# Altium project IRControlArduino.PrjPcb
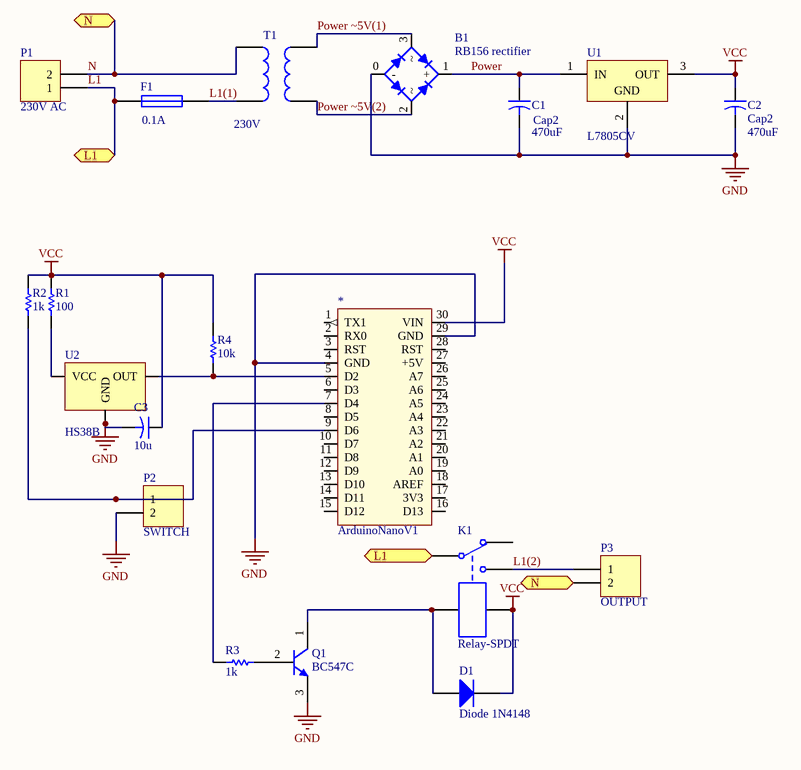
[diagram p0: schemat.SchDoc]
1 sheet, 19 parts. Net scope: flat (ports and power ports of the same name join across sheets).
Board file: PCB1.PcbDoc

## Sheet schemat.SchDoc
size A4

### Parts
*  ArduinoNanoV1  [DIP30]
B1  RB156 rectifier  [RB15]
C1  Cap2  value 470uF  [CAPR5-4X5]
C2  Cap2  value 470uF  [CAPR5-4X5]
C3  value 10u  [Capacitor]  (hidden comment: Cap2)
D1  Diode 1N4148  [DO-35]
F1  current: 0.1A  [PIN-W2/E2.8]  (hidden comment: Fuse 1)
K1  Relay-SPDT  [RELAY_OMRON_G5LE-1]
P1  230V AC  [ARK2]
P2  SWITCH  [ARK2]
P3  OUTPUT  [ARK2]
Q1  BC547C  [ONSC-TO-92-3-29-10_BL]
R1  value 100  [AXIAL-0.3]  (hidden comment: Res1)
R2  value 1k  [AXIAL-0.3]  (hidden comment: Res1)
R3  value 1k  [AXIAL-0.3]  (hidden comment: Res1)
R4  value 10k  [AXIAL-0.3]  (hidden comment: Res1)
T1  input voltage: 230V  [trafo HAHN 12V 3VA]  (hidden comment: Trans)
U1  L7805CV  [TO220]
U2  HS38B  [HS38B_3pin]

### Ports
L1, N

### Nets
GND: *.4(GND) *.29(GND) B1.0(-) C1.2 C2.2 C3.2 P2.2 Q1.3(E) U1.2(GND) U2.2(GND)
VCC: *.30(VIN) C2.1 C3.1 D1.2(K) K1.5 R1.2 R2.2 R4.2 U1.3(OUT)
L1: F1.1 K1.1 P1.1 ; port L1
L1(1): F1.2 T1.2
L1(2): K1.3 P3.1
N: P1.2 P3.2 T1.1 ; port N
Power: B1.1(+) C1.1 U1.1(IN)
Power ~5V(1): B1.3 T1.3
Power ~5V(2): B1.2 T1.4
Net*_5: *.5(D2) R4.1 U2.3(OUT)
Net*_7: *.7(D4) R3.2
Net*_9: *.9(D6) P2.1 R2.1
NetD1_1: D1.1(A) K1.4 Q1.1(C)
NetQ1_2: Q1.2(B) R3.1
NetR1_1: R1.1 U2.1(VCC)

Not connected (* = marked no-connect by the designer): * 1(TX1) 2(RX0) 3(RST) 6(D3) 8(D5) 10(D7) 11(D8) 12(D9) 13(D10) 14(D11) 15(D12) 16(D13) 17(3V3) 18(AREF) 19(A0) 20(A1) 21(A2) 22(A3) 23(A4) 24(A5) 25(A6) 26(A7) 27(+5V) 28(RST); K1 2

### Library data of the parts
C1-C3 = Cap2: Capacitor; Published: 23-Sep-2002; PackageReference: CAPR5-4X5; Publisher: Altium Limited; PackageDescription: Capacitor; 2 Leads
D1 = Diode 1N4148: High Conductance Fast Diode; Published: 8-Jun-2000; LatestRevisionDate: 17-Jul-2002; LatestRevisionNote: Re-released for DXP Platform.; DatasheetVersion: 1997; PackageReference: DO-35; Publisher: Altium Limited; PackageDescription: Diode, Axial; Body 3.8 x 1.9 mm (LxDia. max), Lead Dia. 0.53 mm (max); Code_JEDEC: DO-204-AH; ComponentLink1Description: Manufacturer Link; ComponentLink1URL: http://www.fairchildsemi.com/; ComponentLink2Description: Datasheet; ComponentLink2URL: http://www.fairchildsemi.com/ds/1N%2F1N4148.pdf
F1 = Fuse 1: Fuse; Published: 8-Jun-2000; LatestRevisionDate: 17-Jul-2002; LatestRevisionNote: Re-released for DXP Platform.; PackageReference: PIN-W2/E2.8; Publisher: Altium Limited; PackageDescription: Thru-Hole; 2 Leads
K1 = Relay-SPDT: Single-Pole Dual-Throw Relay; Published: 24-Mar-1999; LatestRevisionDate: 17-Jul-2002; LatestRevisionNote: Re-released for DXP Platform.; PackageReference: MODULE5B; Publisher: Altium Limited
P1-P3 = Header 2: Header, 2-Pin; pin to pad: 1>2 2>1; LatestRevisionDate: 17-Jul-2002; LatestRevisionNote: Re-released for DXP Platform.; Publisher: Altium Limited
Q1 = BC547C: Amplifier Transistor, NPN Silicon, 3-Pin TO-92, Bulk Box; Manufacturer: On Semiconductor; fT Min (MHz): 150; IC Continuous (A): 0.1; DatasheetVersion: Rev. 7; PackageVersion: Rev. AM; PackageReference: TO-92-3-29-11_AM_SL; PackageDescription: 3-Pin Transistor Outline, Body 4.825 x 3.685 mm, Pitch 1.27 mm; Supplier 1: Digi-Key; Supplier Part Number 1: BC547COS-ND; Packing: Bulk Box; Polarity: NPN; RoHS: FALSE; Mounting Technology: Through Hole; PartNumber: BC547C; ComponentLink1Description: Manufacturer URL; ComponentLink1URL: http://www.onsemi.com/; ComponentLink2Description: Datasheet; ComponentLink2URL: http://www.onsemi.com/pub_link/Collateral/BC546-D.PDF; ComponentLink3Description: Package Specification; ComponentLink3URL: http://www.onsemi.cn/pub_link/Collateral/2N6426-D.PDF
R1-R4 = Res1: Resistor; Published: 8-Jun-2000; LatestRevisionDate: 17-Jul-2002; LatestRevisionNote: Re-released for DXP Platform.; PackageReference: AXIAL-0.3; Publisher: Altium Limited; PackageDescription: Axial Device, Thru-Hole; 2 Leads; 0.3 in Pin Spacing
T1 = Trans: Transformer; output voltage: 12V; Published: 24-Mar-1999; LatestRevisionDate: 08-Jul-2005; LatestRevisionNote: Mech Layer 1 removed.; PackageReference: TRANS; Publisher: Altium Limited; PackageDescription: Transformer; 4 Leads
U1 = L7805CV: Positive Voltage Regulator, 5V, 3-Pin TO-220; DatasheetVersion: Nov-2011; PackageVersion: ver3.0; PackageReference: TO220; PackageDescription: TO, Thru-Hole, Vertical, Heatsink Mounted; 3 In-Line Leads; Pitch 2.54 mm; PartNumber: L7805CV; ComponentLink1Description: Manufacturer URL; ComponentLink1URL: http://www.st.com; ComponentLink2Description: Datasheet; ComponentLink2URL: http://www.st.com/internet/com/TECHNICAL_RESOURCES/TECHNICAL_LITERATURE/DATASHEET/CD00000444.pdf; ComponentLink3Description: Package Specification; ComponentLink3URL: http://www.st.com/internet/com/TECHNICAL_RESOURCES/TECHNICAL_LITERATURE/PACKAGE_INFORMATION/CD00004649.pdf